# Altium schematic sheet QCopterFC_MCU_Sch.SchDoc
size A4
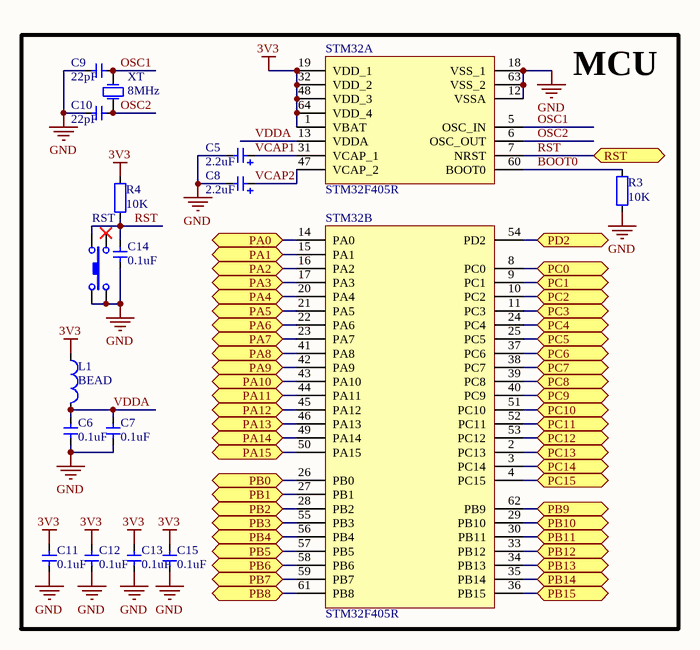
[diagram p0: QCopterFC_MCU_Sch.SchDoc]

## Parts
C5  value 2.2uF  [CAP_TAN_P0805]  (hidden comment: Cap_Tan_0805)
C6  value 0.1uF  [CAP_0603]  (hidden comment: Cap_0603)
C7  value 0.1uF  [CAP_0603]  (hidden comment: Cap_0603)
C8  value 2.2uF  [CAP_TAN_P0805]  (hidden comment: Cap_Tan_0805)
C9  value 22pF  [CAP_0603]  (hidden comment: Cap_0603)
C10  value 22pF  [CAP_0603]  (hidden comment: Cap_0603)
C11  value 0.1uF  [CAP_0603]  (hidden comment: Cap_0603)
C12  value 0.1uF  [CAP_0603]  (hidden comment: Cap_0603)
C13  value 0.1uF  [CAP_0603]  (hidden comment: Cap_0603)
C14  value 0.1uF  [CAP_0603]  (hidden comment: Cap_0603)
C15  value 0.1uF  [CAP_0603]  (hidden comment: Cap_0603)
L1  value BEAD  [IND_0603]  (hidden comment: Ind_0603)
R3  value 10K  [RES_0603]  (hidden comment: Res_0603)
R4  value 10K  [RES_0603]  (hidden comment: Res_0603)
RST  BT_TACT_3.5*5_90  [BT_TACT_3.5*3.55_90]  (value not drawn)
STM32  STM32F405R  [STM32_QFP64]  (parts A,B of 2)
XT  value 8MHz  [XTAL_5032]  (hidden comment: XTAL_5032_2P)

## Blocks framed on the sheet
MCU: C5-C15 L1 R3 R4 RST STM32 XT

## Ports
PA0, PA1, PA2, PA3, PA4, PA5, PA6, PA7, PA8, PA9, PA10, PA11, PA12, PA13, PA14, PA15, PB0, PB1, PB2, PB3, PB4, PB5, PB6, PB7, PB8, PB9, PB10, PB11, PB12, PB13, PB14, PB15, PC0, PC1, PC2, PC3, PC4, PC5, PC6, PC7, PC8, PC9, PC10, PC11, PC12, PC13, PC14, PC15, PD2, RST

## Nets
3V3: C11.1 C12.1 C13.1 C15.1 L1.1 R4.2 STM32.1(VBAT) STM32.19(VDD_1) STM32.32(VDD_2) STM32.48(VDD_3) STM32.64(VDD_4)
GND: C5.2 C6.1 C7.1 C8.2 C9.1 C10.1 C11.2 C12.2 C13.2 C14.2 C15.2 R3.1 RST.1 RST.3 STM32.12(VSSA) STM32.18(VSS_1) STM32.63(VSS_2)
BOOT0: R3.2 STM32.60(BOOT0)
OSC1: C9.2 STM32.5(OSC_IN) XT.2(OSC2)
OSC2: C10.2 STM32.6(OSC_OUT) XT.1(OSC1)
PA0: STM32.14(PA0) ; port PA0
PA1: STM32.15(PA1) ; port PA1
PA2: STM32.16(PA2) ; port PA2
PA3: STM32.17(PA3) ; port PA3
PA4: STM32.20(PA4) ; port PA4
PA5: STM32.21(PA5) ; port PA5
PA6: STM32.22(PA6) ; port PA6
PA7: STM32.23(PA7) ; port PA7
PA8: STM32.41(PA8) ; port PA8
PA9: STM32.42(PA9) ; port PA9
PA10: STM32.43(PA10) ; port PA10
PA11: STM32.44(PA11) ; port PA11
PA12: STM32.45(PA12) ; port PA12
PA13: STM32.46(PA13) ; port PA13
PA14: STM32.49(PA14) ; port PA14
PA15: STM32.50(PA15) ; port PA15
PB0: STM32.26(PB0) ; port PB0
PB1: STM32.27(PB1) ; port PB1
PB2: STM32.28(PB2) ; port PB2
PB3: STM32.55(PB3) ; port PB3
PB4: STM32.56(PB4) ; port PB4
PB5: STM32.57(PB5) ; port PB5
PB6: STM32.58(PB6) ; port PB6
PB7: STM32.59(PB7) ; port PB7
PB8: STM32.61(PB8) ; port PB8
PB9: STM32.62(PB9) ; port PB9
PB10: STM32.29(PB10) ; port PB10
PB11: STM32.30(PB11) ; port PB11
PB12: STM32.33(PB12) ; port PB12
PB13: STM32.34(PB13) ; port PB13
PB14: STM32.35(PB14) ; port PB14
PB15: STM32.36(PB15) ; port PB15
PC0: STM32.8(PC0) ; port PC0
PC1: STM32.9(PC1) ; port PC1
PC2: STM32.10(PC2) ; port PC2
PC3: STM32.11(PC3) ; port PC3
PC4: STM32.24(PC4) ; port PC4
PC5: STM32.25(PC5) ; port PC5
PC6: STM32.37(PC6) ; port PC6
PC7: STM32.38(PC7) ; port PC7
PC8: STM32.39(PC8) ; port PC8
PC9: STM32.40(PC9) ; port PC9
PC10: STM32.51(PC10) ; port PC10
PC11: STM32.52(PC11) ; port PC11
PC12: STM32.53(PC12) ; port PC12
PC13: STM32.2(PC13) ; port PC13
PC14: STM32.3(PC14) ; port PC14
PC15: STM32.4(PC15) ; port PC15
PD2: STM32.54(PD2) ; port PD2
RST: C14.1 R4.1 RST.2 STM32.7(NRST) ; port RST
VCAP1: C5.1 STM32.31(VCAP_1)
VCAP2: C8.1 STM32.47(VCAP_2)
VDDA: C6.2 C7.2 L1.2 STM32.13(VDDA)

Not connected (* = marked no-connect by the designer): RST 4*

## Library data of the parts
C5 C8 = Cap_Tan_0805: Capacitor
C6 C7 C9-C15 = Cap_0603: Capacitor
L1 = Ind_0603: Inductor
R3 R4 = Res_0603: Resistor
RST = BT_TACT_3.5*5_90: Switch
STM32 = STM32F405R: MCU
XT = XTAL_5032_2P: Crystal Oscillator